# Altium schematic sheet Power_2.SchDoc
size A4
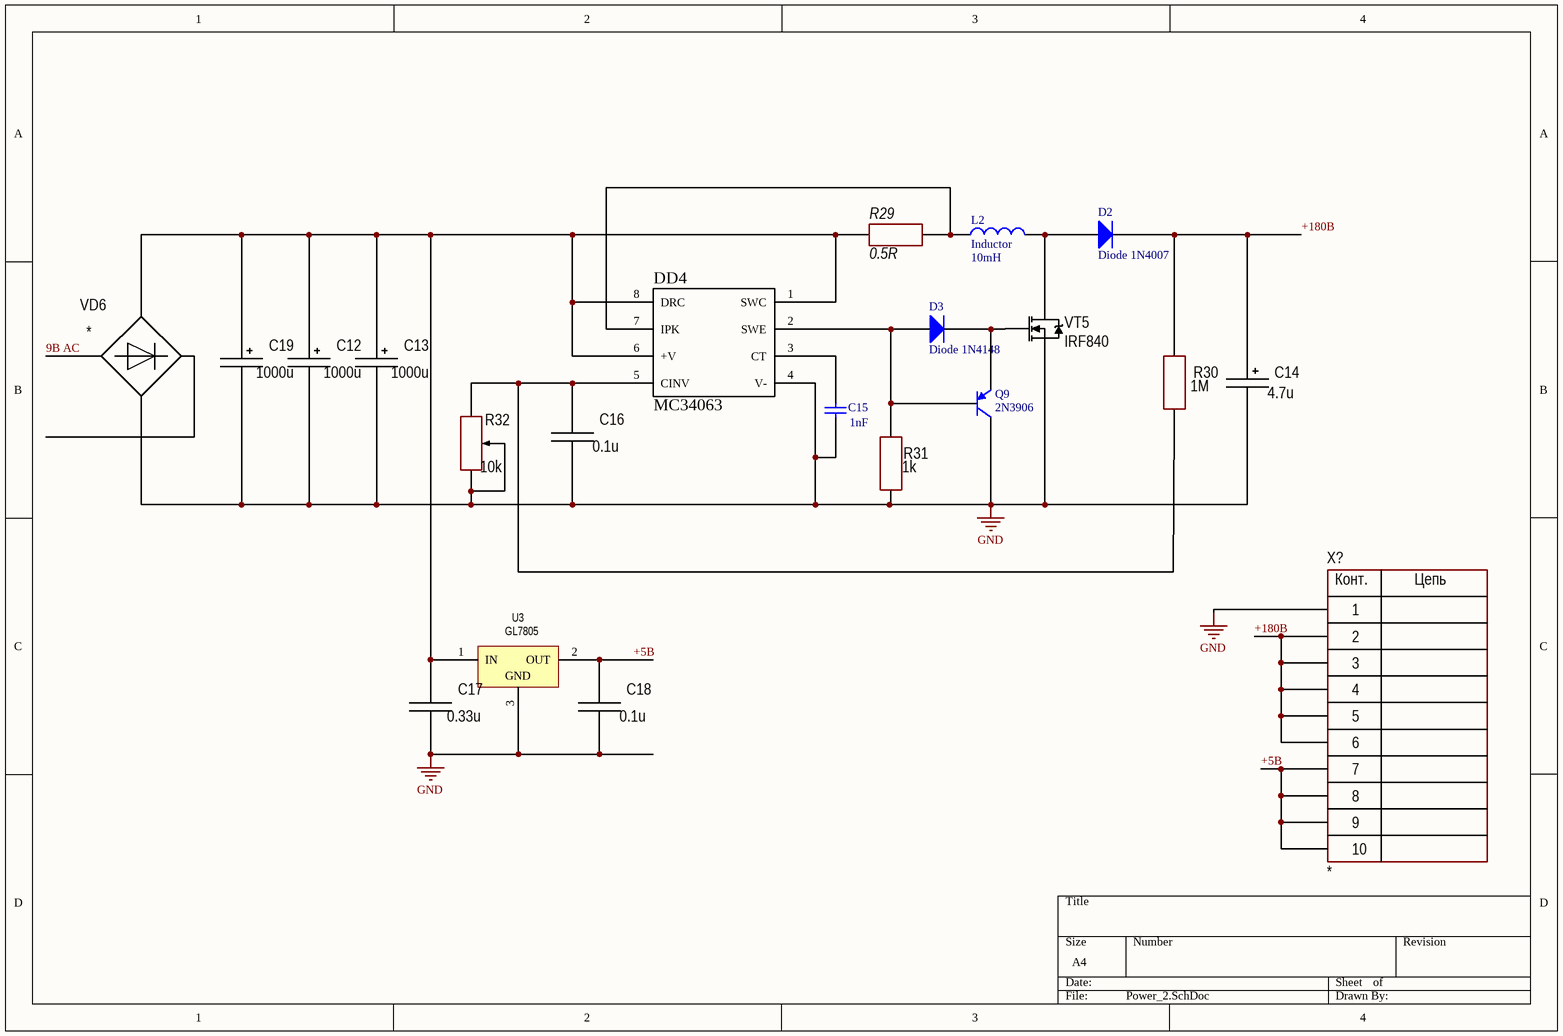
[diagram p0: Power_2.SchDoc]

## Parts
C12  1000u  [D5C2H11]
C13  1000u  [D5C2H11]
C14  4.7u  [D8C3.5H12]
C15  value 1nF  [C1206]  (hidden comment: Cap)
C16  0.1u  [CAP: DEBB33D]
C17  0.33u  [CAP: DEBB33D]
C18  0.1u  [CAP: DEBB33D]
C19  1000u  [D5C2H11]
D2  Diode 1N4007  [DO-41]
D3  Diode 1N4148  [DO-35]
DD4  MC34063  [MAX1771_DIP8 - duplicate]
L2  Inductor  value 10mH  [Ferrite_ring]
Q9  2N3906  [TO-92A]
R29  0.5R  [MLT]
R30  1M  [CH1206R]
R31  1k  [CH1206R]
R32  10k  [RES: 3296W]
U3  GL7805  [TO220VW]
VD6  *  [DIOD: DF206S-G]
VT5  IRF840  [DPAK]
X?  *  [CON: S10B-PHD]

## Nets
GND: C12.2 C13.2 C14.2 C15.1 C16.2 C17.2 C18.2 C19.2 DD4.4(V-) Q9.3(C) R31.2 R32.2 R32.3 U3.3(GND) VD6.4 VT5.3(S) X?.1
9В AC: VD6.1
+5В: C18.1 U3.2(OUT) X?.7 X?.8 X?.9 X?.10
+180В: C14.1 D2.2(K) R30.1 X?.2 X?.3 X?.4 X?.5 X?.6
NetC12_1: C12.1 C13.1 C17.1 C19.1 DD4.1(SWC) DD4.6(+V) DD4.8(DRC) R29.1 U3.1(IN) VD6.2
NetC15_2: C15.2 DD4.3(CT)
NetC16_1: C16.1 DD4.5(CINV) R30.2 R32.1
NetD2_1: D2.1(A) L2.2 VT5.2(D)
NetD3_1: D3.1(A) DD4.2(SWE) Q9.2(B) R31.1
NetD3_2: D3.2(K) Q9.1(E) VT5.1(G)
NetDD4_7: DD4.7(IPK) L2.1 R29.2

Not connected (* = marked no-connect by the designer): VD6 3

## Notes on the sheet
- (in symbol 10-Connector) Конт.; Цепь

## Library data of the parts
C12-C14 C19 = AlumCap: Manufacturer: *; Model: *; HelpURL: *; ComponentKind: *; Value: *
C15 = Cap Semi: Capacitor (Semiconductor SIM Model); Published: 8-Jun-2000; LatestRevisionDate: 29-May-2009; LatestRevisionNote: IPC-7351 Footprint Added.; PackageReference: C1206; Publisher: Altium Limited; PackageDescription: Chip Capacitor
C16-C18 = Capacitor: Manufacturer: *; Model: *; HelpURL: *; ComponentKind: *; Value: *
D2 = Diode 1N4007: 1 Amp General Purpose Rectifier; Published: 8-Jun-2000; LatestRevisionDate: 17-Jul-2002; LatestRevisionNote: Re-released for DXP Platform.; DatasheetVersion: 1998; PackageVersion: Aug-1999; PackageReference: DO-41; Publisher: Altium Limited; PackageDescription: Diode, Axial; Body 5.2 x 2.7 mm (LxDia. max), Lead Dia. 0.86 mm (max); Code_JEDEC: DO-204-AL; ComponentLink1Description: Manufacturer Link; ComponentLink1URL: http://www.fairchildsemi.com/; ComponentLink2Description: Datasheet; ComponentLink2URL: http://www.fairchildsemi.com/ds/1N%2F1N4001.pdf
D3 = Diode 1N4148: High Conductance Fast Diode; Published: 8-Jun-2000; LatestRevisionDate: 17-Jul-2002; LatestRevisionNote: Re-released for DXP Platform.; DatasheetVersion: 1997; PackageReference: DO-35; Publisher: Altium Limited; PackageDescription: Diode, Axial; Body 3.8 x 1.9 mm (LxDia. max), Lead Dia. 0.53 mm (max); Code_JEDEC: DO-204-AH; ComponentLink1Description: Manufacturer Link; ComponentLink1URL: http://www.fairchildsemi.com/; ComponentLink2Description: Datasheet; ComponentLink2URL: http://www.fairchildsemi.com/ds/1N%2F1N4148.pdf
L2 = Inductor: Code_IEC: 1005; Published: 8-Jun-2000; LatestRevisionDate: 29-May-2009; LatestRevisionNote: IPC-7351 Footprint Added.; PackageReference: 0402-A; Publisher: Altium Limited; PackageDescription: Chip Inductor; Code_JEITA: 0402
Q9 = 2N3906: PNP General Purpose Amplifier; Published: 8-Jun-2000; LatestRevisionDate: 15-Jan-2003; LatestRevisionNote: PCB Footprint 'BCY-W3/D4.7' replaced; DatasheetVersion: 1997; PackageVersion: Sep-1998; PackageReference: TO-92A; Publisher: Altium Limited; PackageDescription: TO, Flat Index; 3 In-Line, Axial Leads; Body Dia. 4.5mm; Leads 0.51 x 0.48 mm (max); ComponentLink1Description: Manufacturer Link; ComponentLink1URL: http://www.fairchildsemi.com/; ComponentLink2Description: Datasheet; ComponentLink2URL: http://www.fairchildsemi.com/ds/2N%2F2N3906.pdf
R29 = Resistor: MLT; Model: *; Manufacture: *; HelpURL: *; Case: *; Value: *
R30 R31 = Resistor: Manufacturer: *; Model: *; HelpURL: *; ComponentKind: *; Value: *
R32 = ADJ resistor: Manufacturer: *; Model: *; HelpURL: *; ComponentKind: *; Value: *
U3 = L78S05CV: 2A Positive Voltage Regulator; Note: Tab is connected to pin 3 (GND).; Published: 24-Aug-2001; LatestRevisionDate: 17-Jul-2002; LatestRevisionNote: Re-released for DXP Platform.; DatasheetVersion: Jan-1993; PackageVersion: Apr-1998; PackageReference: TO220VW; Publisher: Altium Limited; PackageDescription: TO, Thru-Hole, Vertical, Heatsink Mounted; 3 In-Line Leads; Pitch 2.54 mm; Pin sequence 1, 3, 2; ComponentLink1Description: Manufacturer Link; ComponentLink1URL: http://www.st.com/; ComponentLink2Description: Datasheet; ComponentLink2URL: http://www.st.com/stonline/products/literature/ds/2148/l78s10c.pdf
VD6 = Bridge: ComponentKind: *; Manufacturer: *; Model: *; HelpURL: *
VT5 = N-chanel: Mosfet; Model: *; Manufacturer: *; ComponentKind: *; HelpURL: *
X? = 10-Connector: Model: *; Manufacturer: *; HelpURL: *; ComponentKind: *